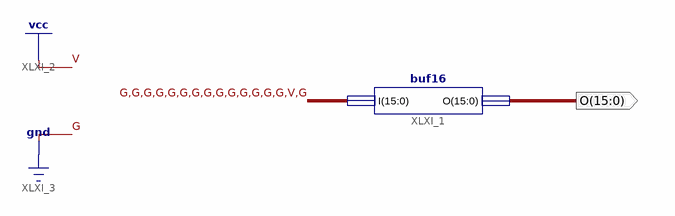
[diagram p0: schematic sheet 1]
// Xilinx ISE schematic constant16b0010.sch (spartan3e) as structural Verilog: 1 symbols, 1 ports
module constant16b0010 (
  output [15:0] O
);

  buf16 XLXI_1 (.I(16'b0000000000000010), .O(O));
endmodule
